# Altium schematic sheet WCH-Link-R1.SchDoc
size A4
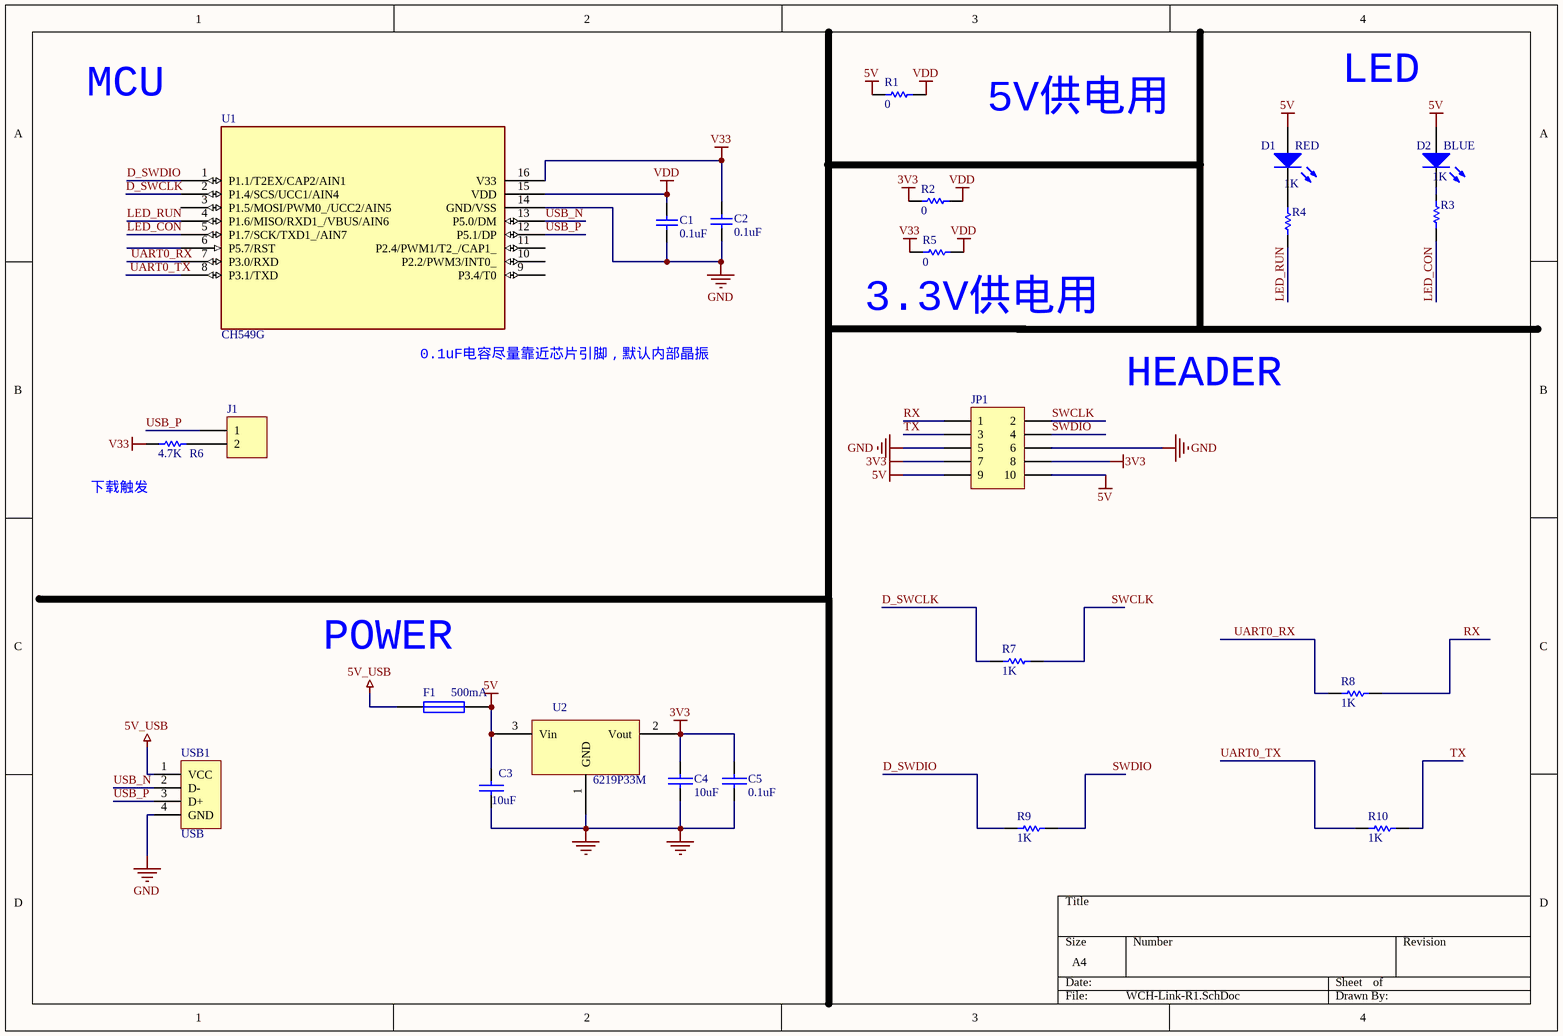
[diagram p0: WCH-Link-R1.SchDoc]

## Parts
C1  0.1uF  [0603_C]
C2  0.1uF  [0603_C]
C3  10uF  [3216_C]
C4  10uF  [3216_C]
C5  0.1uF  [0603_C]
D1  RED  [0603+]
D2  BLUE  [0603+]
F1  500mA  [0805]
J1  Header 2  [SIP2-2.54MM]  (value not drawn)
JP1  Header 5*2  [IDCS10-2.54mm]  (value not drawn)
R1  0  [0603]
R2  0  [0603]
R3  1K  [0603]
R4  1K  [0603]
R5  0  [0603]
R6  4.7K  [0603]
R7  1K  [0603]
R8  1K  [0603]
R9  1K  [0603]
R10  1K  [0603]
U1  CH549G  [SOP16]
U2  6219P33M  [SOT-23]
USB1  USB  [USB-A-F/P_B]

## Nets
3V3: C4.1 C5.1 JP1.7 JP1.8 R2.2 U2.2(Vout)
5V: C3.1 D1.1(A) D2.1(A) F1.2 JP1.9 JP1.10 R1.2 U2.3(Vin)
5V_USB: F1.1 USB1.1(VCC)
GND: C1.2 C2.2 C3.2 C4.2 C5.2 JP1.5 JP1.6 U1.14(GND/VSS) U2.1(GND) USB1.4(GND)
V33: C2.1 R5.2 R6.2 U1.16(V33)
VDD: C1.1 R1.1 R2.1 R5.1 U1.15(VDD)
D_SWCLK: R7.2 U1.2(P1.4/SCS/UCC1/AIN4)
D_SWDIO: R9.2 U1.1(P1.1/T2EX/CAP2/AIN1)
LED_CON: R3.1 U1.5(P1.7/SCK/TXD1_/AIN7)
LED_RUN: R4.1 U1.4(P1.6/MISO/RXD1_/VBUS/AIN6)
RX: JP1.1 R8.1
SWCLK: JP1.2 R7.1
SWDIO: JP1.4 R9.1
TX: JP1.3 R10.1
UART0_RX: R8.2 U1.7(P3.0/RXD)
UART0_TX: R10.2 U1.8(P3.1/TXD)
USB_N: U1.13(P5.0/DM) USB1.2(D-)
USB_P: J1.1 U1.12(P5.1/DP) USB1.3(D+)
NetD1_2: D1.2(K) R4.2
NetD2_2: D2.2(K) R3.2
NetJ1_2: J1.2 R6.1

Not connected (* = marked no-connect by the designer): U1 3(P1.5/MOSI/PWM0_/UCC2/AIN5) 6(P5.7/RST) 9(P3.4/T0) 10(P2.2/PWM3/INT0_) 11(P2.4/PWM1/T2_/CAP1_)

## Notes on the sheet
- MCU
- LED
- 5V供电用
- (near R5) 3.3V供电用
- 0.1uF电容尽量靠近芯片引脚，默认内部晶振
- HEADER
- (near R6) 下载触发
- (near F1) POWER

## Library data of the parts
C1 C2 = C0603: Capacitor; Published: 8-Jun-2000; LatestRevisionDate: 17-Jul-2002; LatestRevisionNote: Re-released for DXP Platform.; PackageReference: RAD-0.3; Publisher: Altium Limited; PackageDescription: Radial Cap, Thru-Hole; 2 Leads; 0.3 in Pin Spacing
C3-C5 = CAP: Capacitor
D1 D2 = D0603: Typical RED, GREEN, YELLOW, AMBER GaAs LED; Published: 8-Jun-2000; LatestRevisionDate: 17-Jul-2002; LatestRevisionNote: Re-released for DXP Platform.; PackageVersion: Feb-2002; PackageReference: 3.2X1.6X1.1; Publisher: Altium Limited; PackageDescription: SM LED; 2 Flat Leads
F1 = FUSE1: Fuse
J1 = Header 2: Header, 2-Pin; LatestRevisionDate: 17-Jul-2002; LatestRevisionNote: Re-released for DXP Platform.; Publisher: Altium Limited
JP1 = Header_5*2: Header, 10Pin; LatestRevisionDate: 17-Jul-2002; LatestRevisionNote: Re-released for DXP Platform.; Publisher: Altium Limited
R1-R10 = R0603: Resistor; Published: 8-Jun-2000; LatestRevisionDate: 17-Jul-2002; LatestRevisionNote: Re-released for DXP Platform.; PackageReference: AXIAL-0.3; Publisher: Altium Limited; PackageDescription: Axial Device, Thru-Hole; 2 Leads; 0.3 in Pin Spacing
U1 = CH549G: 8bit MCS51 MCU with ADC & USB type-C host & device & dual UART & SPI
USB1 = USB_G